# Altium schematic sheet 00_POWER.SchDoc
size A4
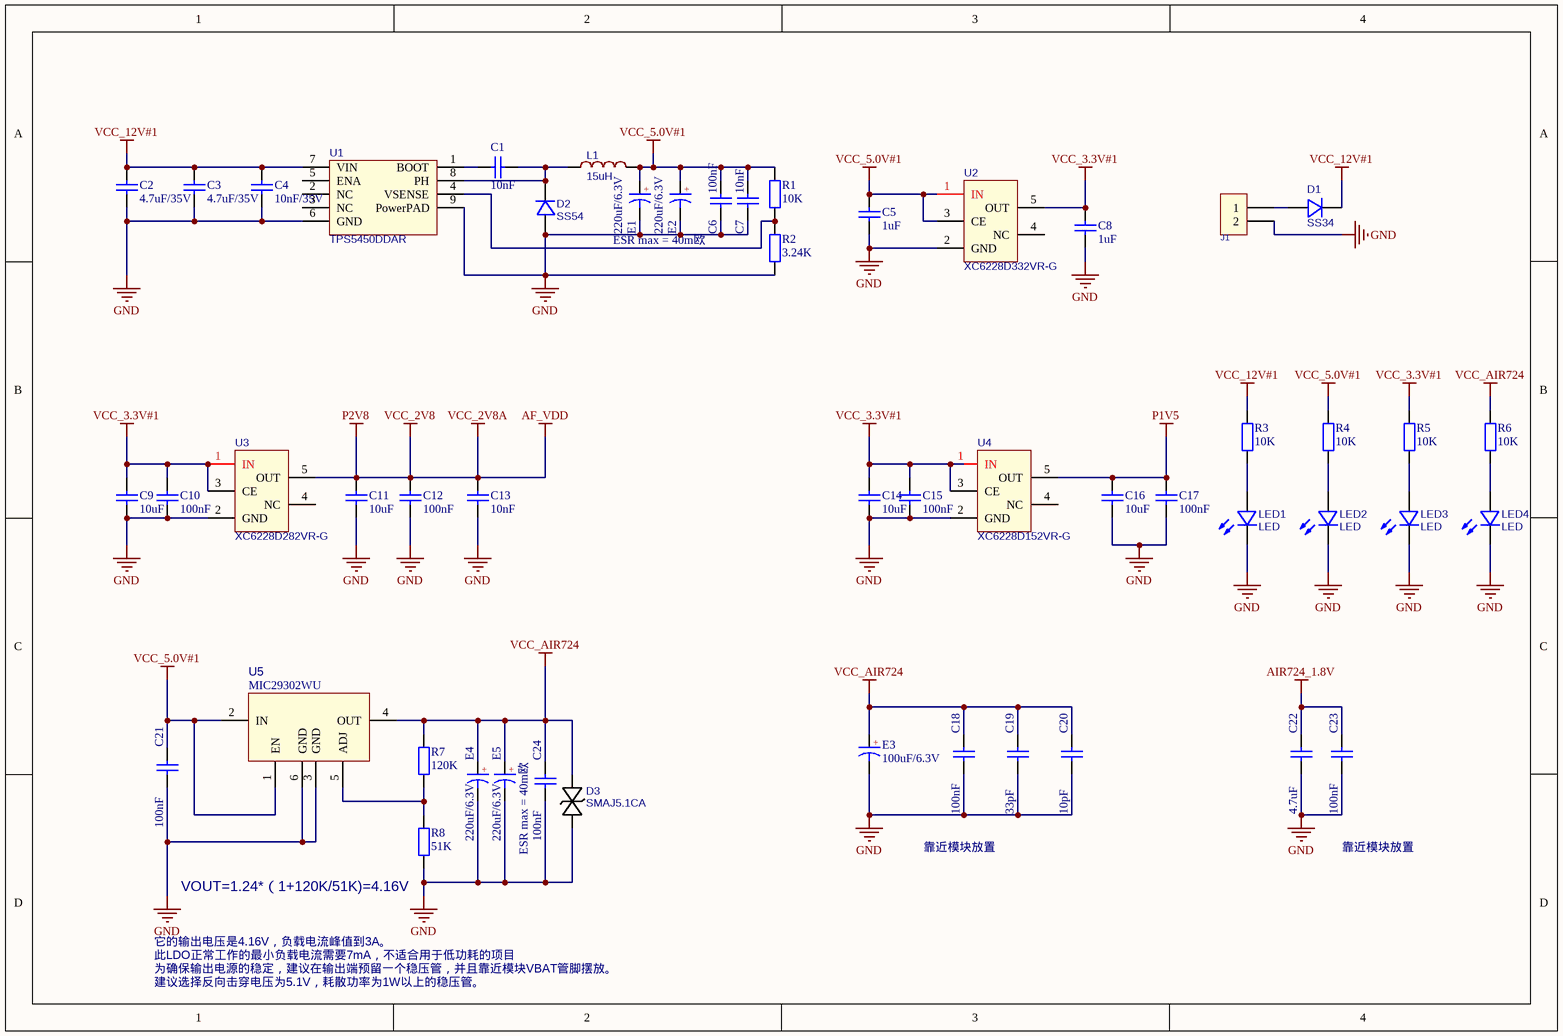
[diagram p0: 00_POWER.SchDoc]

## Parts
C1  10nF  [0603-C]
C2  4.7uF/35V  [0805-C]
C3  4.7uF/35V  [0805-C]
C4  10nF/35V  [0603-C]
C5  1uF  [0603-C]
C6  100nF  [0603-C]
C7  10nF  [0603-C]
C8  1uF  [0603-C]
C9  10uF  [0603-C]
C10  100nF  [0603-C]
C11  10uF  [0603-C]
C12  100nF  [0603-C]
C13  10nF  [0603-C]
C14  10uF  [0603-C]
C15  100nF  [0603-C]
C16  10uF  [0603-C]
C17  100nF  [0603-C]
C18  100nF  [0603-C]
C19  33pF  [0603-C]
C20  10pF  [0603-C]
C21  100nF  [0603-C]
C22  4.7uF  [0603-C]
C23  100nF  [0603-C]
C24  100nF  [0603-C]
D1  SS34  [SS34-SMA]
D2  SS54  [SS34-SMA]
D3  SMAJ5.1CA  [ZENER]
E1  220uF/6.3V  [CD B(3528)]
E2  220uF/6.3V  [CD B(3528)]
E3  100uF/6.3V  [CD B(3528)]
E4  220uF/6.3V  [CD B(3528)]
E5  220uF/6.3V  [CD B(3528)]
J1  KF128-5.0-2P  [KF128-5.0-2P]  (value not drawn)
L1  15uH  [电感7*7*3]
LED1  LED  [LED-0603]
LED2  LED  [LED-0603]
LED3  LED  [LED-0603]
LED4  LED  [LED-0603]
R1  10K  [0603-R]
R2  3.24K  [0603-R]
R3  10K  [0603-R]
R4  10K  [0603-R]
R5  10K  [0603-R]
R6  10K  [0603-R]
R7  120K  [0603-R]
R8  51K  [0603-R]
U1  TPS5450DDAR  [TPS5430]
U2  XC6228D332VR-G  [XC6228D332VR-G]
U3  XC6228D282VR-G  [XC6228D332VR-G]
U4  XC6228D152VR-G  [XC6228D332VR-G]
U5  MIC29302WU  [MIC29302WU]

## Nets
AF_VDD: C11.2 C12.2 C13.2 U3.5(OUT)  [also labelled P2V8, VCC_2V8, VCC_2V8A]
AIR724_1.8V: C22.2 C23.2
GND: C2.2 C3.2 C4.1 C5.1 C6.2 C7.2 C8.1 C9.1 C10.1 C11.1 C12.1 C13.1 C14.1 C15.1 C16.1 C17.1 C18.1 C19.1 C20.1 C21.1 C22.1 C23.1 C24.1 D2.1(+) D3.2(A) E1.2(K) E2.2(K) E3.2(K) E4.2(K) E5.2(K) J1.2 LED1.1(-) LED2.1(-) LED3.1(-) LED4.1(-) R2.2 R8.2 U1.6(GND) U1.9(PowerPAD) U2.2(GND) U3.2(GND) U4.2(GND) U5.3(GND) U5.6(GND)
P1V5: C16.2 C17.2 U4.5(OUT)
VCC_3.3V#1: C8.2 C9.2 C10.2 C14.2 C15.2 R5.2 U2.5(OUT) U3.1(IN) U3.3(CE) U4.1(IN) U4.3(CE)
VCC_5.0V#1: C5.2 C6.1 C7.1 C21.2 E1.1(A) E2.1(A) L1.2 R1.1 R4.2 U2.1(IN) U2.3(CE) U5.1(EN) U5.2(IN)
VCC_12V#1: C2.1 C3.1 C4.2 D1.2(-) R3.2 U1.7(VIN)
VCC_AIR724: C18.2 C19.2 C20.2 C24.2 D3.1(C) E3.1(A) E4.1(A) E5.1(A) R6.2 R7.1 U5.4(OUT)
NetC1_1: C1.1 D2.2(-) L1.1 U1.8(PH)
NetC1_2: C1.2 U1.1(BOOT)
NetD1_1: D1.1(+) J1.1
NetLED1_2: LED1.2(+) R3.1
NetLED2_2: LED2.2(+) R4.1
NetLED3_2: LED3.2(+) R5.1
NetLED4_2: LED4.2(+) R6.1
NetR1_2: R1.2 R2.1 U1.4(VSENSE)
NetR7_2: R7.2 R8.1 U5.5(ADJ)

Not connected (* = marked no-connect by the designer): U1 2(NC) 3(NC) 5(ENA); U2 4(NC); U3 4(NC); U4 4(NC)

## Notes on the sheet
- ESR max = 40m欧
- 靠近模块放置
- (near R8) VOUT=1.24*（1+120K/51K)=4.16V
- 它的输出电压是4.16V，负载电流峰值到3A。
- 为确保输出电源的稳定，建议在输出端预留一个稳压管，并且靠近模块VBAT管脚摆放。
- 建议选择反向击穿电压为5.1V，耗散功率为1W以上的稳压管。
- 此LDO正常工作的最小负载电流需要7mA，不适合用于低功耗的项目
- (in symbol CT) +

## Library data of the parts
C1-C24 = C: 贴片电容; BOM名称: 无极性贴片电容; 联系卖家，免费查找封装: 唯一出售店铺网址https://shop463601444.taobao.com
D1 D2 = SS34: BOM_Manufacturer: Wuxi ARK Tech Elec; BOM_Manufacturer Part: D-G060306G1-KS2; Contributor: LCSC; BOM_Supplier: LCSC; BOM_Supplier Part: C118334; BOM_JLCPCB Part Class: Extended Part; spicePre: L; spiceSymbolName: D-G060306G1-KS2
D3 = SMAJ6.0CA: SMAJ6.0CA_C698928; BOM_Manufacturer: Yangzhou Yangjie Elec Tech; Contributor: LCSC; BOM_Supplier: LCSC; BOM_Supplier Part: C698928; BOM_Manufacturer Part: SMAJ6.0CA; BOM_JLCPCB Part Class: Extended Part; spicePre: D; spiceSymbolName: SMAJ6.0CA_C698928
E1-E5 = CT: 贴片钽电容; 联系卖家，免费查找封装: 唯一出售店铺网址https://shop463601444.taobao.com; BOM名称: 贴片钽电容
J1 = KF128-5.0-2P: Manufacturer: KEFA(科发); Add into BOM: yes; Pitch: 5mm; Structure: 1x2P; Number of PINs Per Row: 2; Current Rating (Max): 24A; Voltage Rating (Max): 250V; Wire Gauge - AWG: 12~22; Wire Gauge - mm2: 2.5; Name: KF128-5.0-2P; Symbol: KF128-5.0-2P; Device: KF128-5.0-2P; LCSC Part Name: 5mm 1x2P 排数:1 每排P数:2 直插 可拼接 铜 环保; Supplier Part: C474950; Manufacturer Part: KF128-5.0-2P; Supplier Footprint: 插件,P=5mm; JLCPCB Part Class: Extended Part; Datasheet: https://atta.szlcsc.com/upload/public/pdf/source/20230317/B8CD42C0E3A38C01CD877E6842427715.pdf; Supplier: LCSC; Convert to PCB: yes; Number of Rows: 1; Mounting Style: 直插; Operating Temperature Range: -40℃~+105℃; Color: 绿色; Number of Pins: 2P
L1 = L: BOM_Manufacturer: Sunlord; BOM_Manufacturer Part: UPZ2012D800-4R0TF; nameAlias: Value; Contributor: LCSC; BOM_Supplier: LCSC; BOM_Supplier Part: C145060; BOM_JLCPCB Part Class: Extended Part; spicePre: L; spiceSymbolName: UPZ2012D800-4R0TF
LED1-LED4 = LED: BOM_Manufacturer: Wuxi ARK Tech Elec; BOM_Manufacturer Part: D-G060306G1-KS2; Contributor: LCSC; BOM_Supplier: LCSC; BOM_Supplier Part: C118334; BOM_JLCPCB Part Class: Extended Part; spicePre: L; spiceSymbolName: D-G060306G1-KS2
R1-R8 = R: 贴片电阻; 联系卖家，免费查找封装: 唯一出售店铺网址https://shop463601444.taobao.com; BOM名称: 贴片电阻
U1 = TPS5430DDAR: BOM_Manufacturer: TI; BOM_Supplier: LCSC; BOM_Manufacturer Part: TPS5430DDAR; BOM_Supplier Part: C9864; BOM_JLCPCB Part Class: Basic Part; spicePre: U; spiceSymbolName: TPS5430DDAR
U2 = XC6228D332VR-G: 输出类型：固定 输出极性：正 输出通道数：1 最大输入电压：5.5V 输出电压：3.3V 压差：305mV@(300mA) 输出电流：300mA 电源纹波抑制比(PSRR)：80dB@(1kHz) 3.3V固定输出，Iout=300mA，Vin=5.5V(Max); BOM_Manufacturer: TOREX; BOM_Supplier: LCSC; BOM_Manufacturer Part: XC6228D332VR-G; BOM_Supplier Part: C69841; BOM_JLCPCB Part Class: Extended Part; spicePre: U; spiceSymbolName: XC6228D332VR-G
U3 U4 = XC6228D282VR-G: 输出类型：固定 输出极性：正 输出通道数：1 最大输入电压：5.5V 输出电压：2.8V 压差：305mV@(300mA) 输出电流：300mA 电源纹波抑制比(PSRR)：80dB@(1kHz) 3.3V固定输出，Iout=300mA，Vin=5.5V(Max); BOM_Manufacturer: TOREX; BOM_Supplier: LCSC; BOM_Manufacturer Part: XC6228D332VR-G; BOM_Supplier Part: C69841; BOM_JLCPCB Part Class: Extended Part; spicePre: U; spiceSymbolName: XC6228D332VR-G
U5 = MIC29302WU: Manufacturer: UMW(友台半导体); Symbol: MIC29302WU_C2995533; Add into BOM: yes; Name: MIC29302WU; Device: MIC29302WU; LCSC Part Name: 3A Fast-Response LDO Regulator; Supplier Part: C2995533; Manufacturer Part: MIC29302WU; Supplier Footprint: TO-263; JLCPCB Part Class: Extended Part; Datasheet: https://atta.szlcsc.com/upload/public/pdf/source/20220414/64A379364ACD2069C59BD188E91B8798.pdf; Supplier: LCSC; Convert to PCB: yes